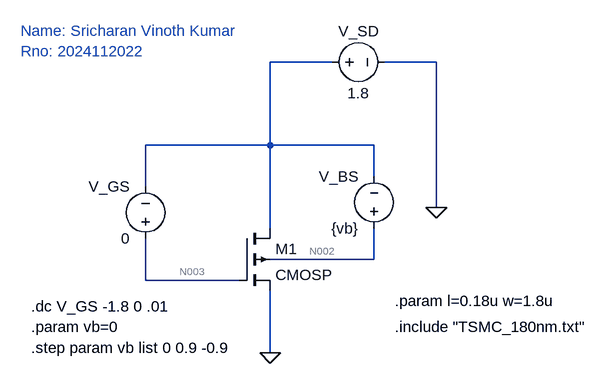
[diagram p0: schematic Draft1.asc]
Draft1.asc, the LTspice schematic file:
Version 4.1
SHEET 1 880 680
WIRE 304 -128 208 -128
WIRE 464 -128 384 -128
WIRE 208 0 208 -128
WIRE 208 0 16 0
WIRE 368 0 208 0
WIRE 368 48 368 0
WIRE 16 64 16 0
WIRE 464 96 464 -128
WIRE 208 128 208 0
WIRE 368 176 368 128
WIRE 368 176 208 176
WIRE 16 208 16 144
WIRE 160 208 16 208
WIRE 208 320 208 224
FLAG 208 320 0
FLAG 464 96 0
SYMBOL pmos4 160 128 R0
SYMATTR InstName M1
SYMATTR Value CMOSP
SYMATTR Value2 l=l w=w ad=2.5*l*w as=2.5*l*w pd=5*l+2*w ps=5*l+2*w
SYMBOL voltage 368 144 R180
WINDOW 0 24 96 Left 2
WINDOW 3 24 16 Left 2
SYMATTR InstName V_BS
SYMATTR Value {vb}
SYMBOL voltage 16 160 R180
WINDOW 0 24 96 Left 2
WINDOW 3 24 16 Left 2
SYMATTR InstName V_GS
SYMATTR Value 0
SYMBOL voltage 288 -128 R270
WINDOW 0 32 56 VTop 2
WINDOW 3 -32 56 VBottom 2
SYMATTR InstName V_SD
SYMATTR Value 1.8
TEXT -176 -176 Left 2 ;Name: Sricharan Vinoth Kumar\nRno: 2024112022
TEXT 400 240 Left 2 !.param l=0.18u w=1.8u
TEXT 400 280 Left 2 !.include "TSMC_180nm.txt"
TEXT -160 248 Left 2 !.dc V_GS -1.8 0 .01
TEXT -160 280 Left 2 !.param vb=0
TEXT -160 312 Left 2 !.step param vb list 0 0.9 -0.9

The netlist it stands for:
* Draft1.asc
M1 N001 N003 0 N002 CMOSP l=l w=w ad=2.5*l*w as=2.5*l*w pd=5*l+2*w ps=5*l+2*w
V_BS N002 N001 {vb}
V_GS N003 N001 0
V_SD N001 0 1.8
.model NMOS NMOS
.model PMOS PMOS
.lib standard.mos
* Name: Sricharan Vinoth Kumar
* Rno: 2024112022
.param l=0.18u w=1.8u
.include "TSMC_180nm.txt"
.dc V_GS -1.8 0 .01
.param vb=0
.step param vb list 0 0.9 -0.9
.backanno
.end

* Results of the author's LTspice run, read from the files saved beside the schematic
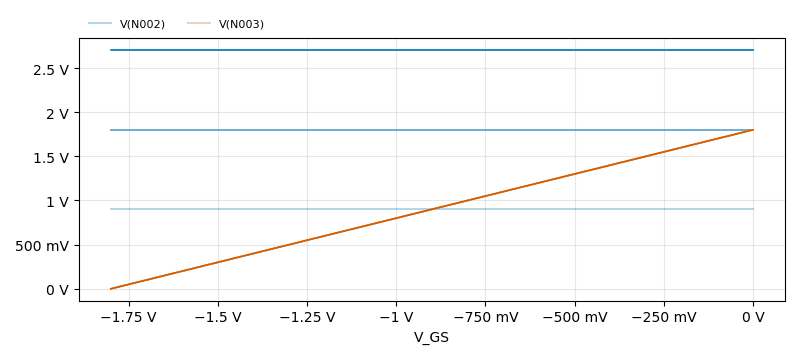
[diagram p1: DC transfer characteristic of Draft1.asc, plotted from the saved traces]
* DC transfer characteristic, 3 runs:
*   V(N002) [vb=-0.9]: 900 mV at V_GS=-1.8 V, 900 mV at V_GS=0 V, min 900 mV, max 900 mV
*   V(N002) [vb=0]: 1.8 V at V_GS=-1.8 V, 1.8 V at V_GS=0 V, min 1.8 V, max 1.8 V
*   V(N002) [vb=0.9]: 2.7 V at V_GS=-1.8 V, 2.7 V at V_GS=0 V, min 2.7 V, max 2.7 V
*   V(N003) [vb=-0.9]: 0 V at V_GS=-1.8 V, 1.8 V at V_GS=0 V, min 0 V, max 1.8 V
*   V(N003) [vb=0]: 0 V at V_GS=-1.8 V, 1.8 V at V_GS=0 V, min 0 V, max 1.8 V
*   V(N003) [vb=0.9]: 0 V at V_GS=-1.8 V, 1.8 V at V_GS=0 V, min 0 V, max 1.8 V